# Altium schematic sheet MCU_MISCELLANEOUS.SchDoc
size A3
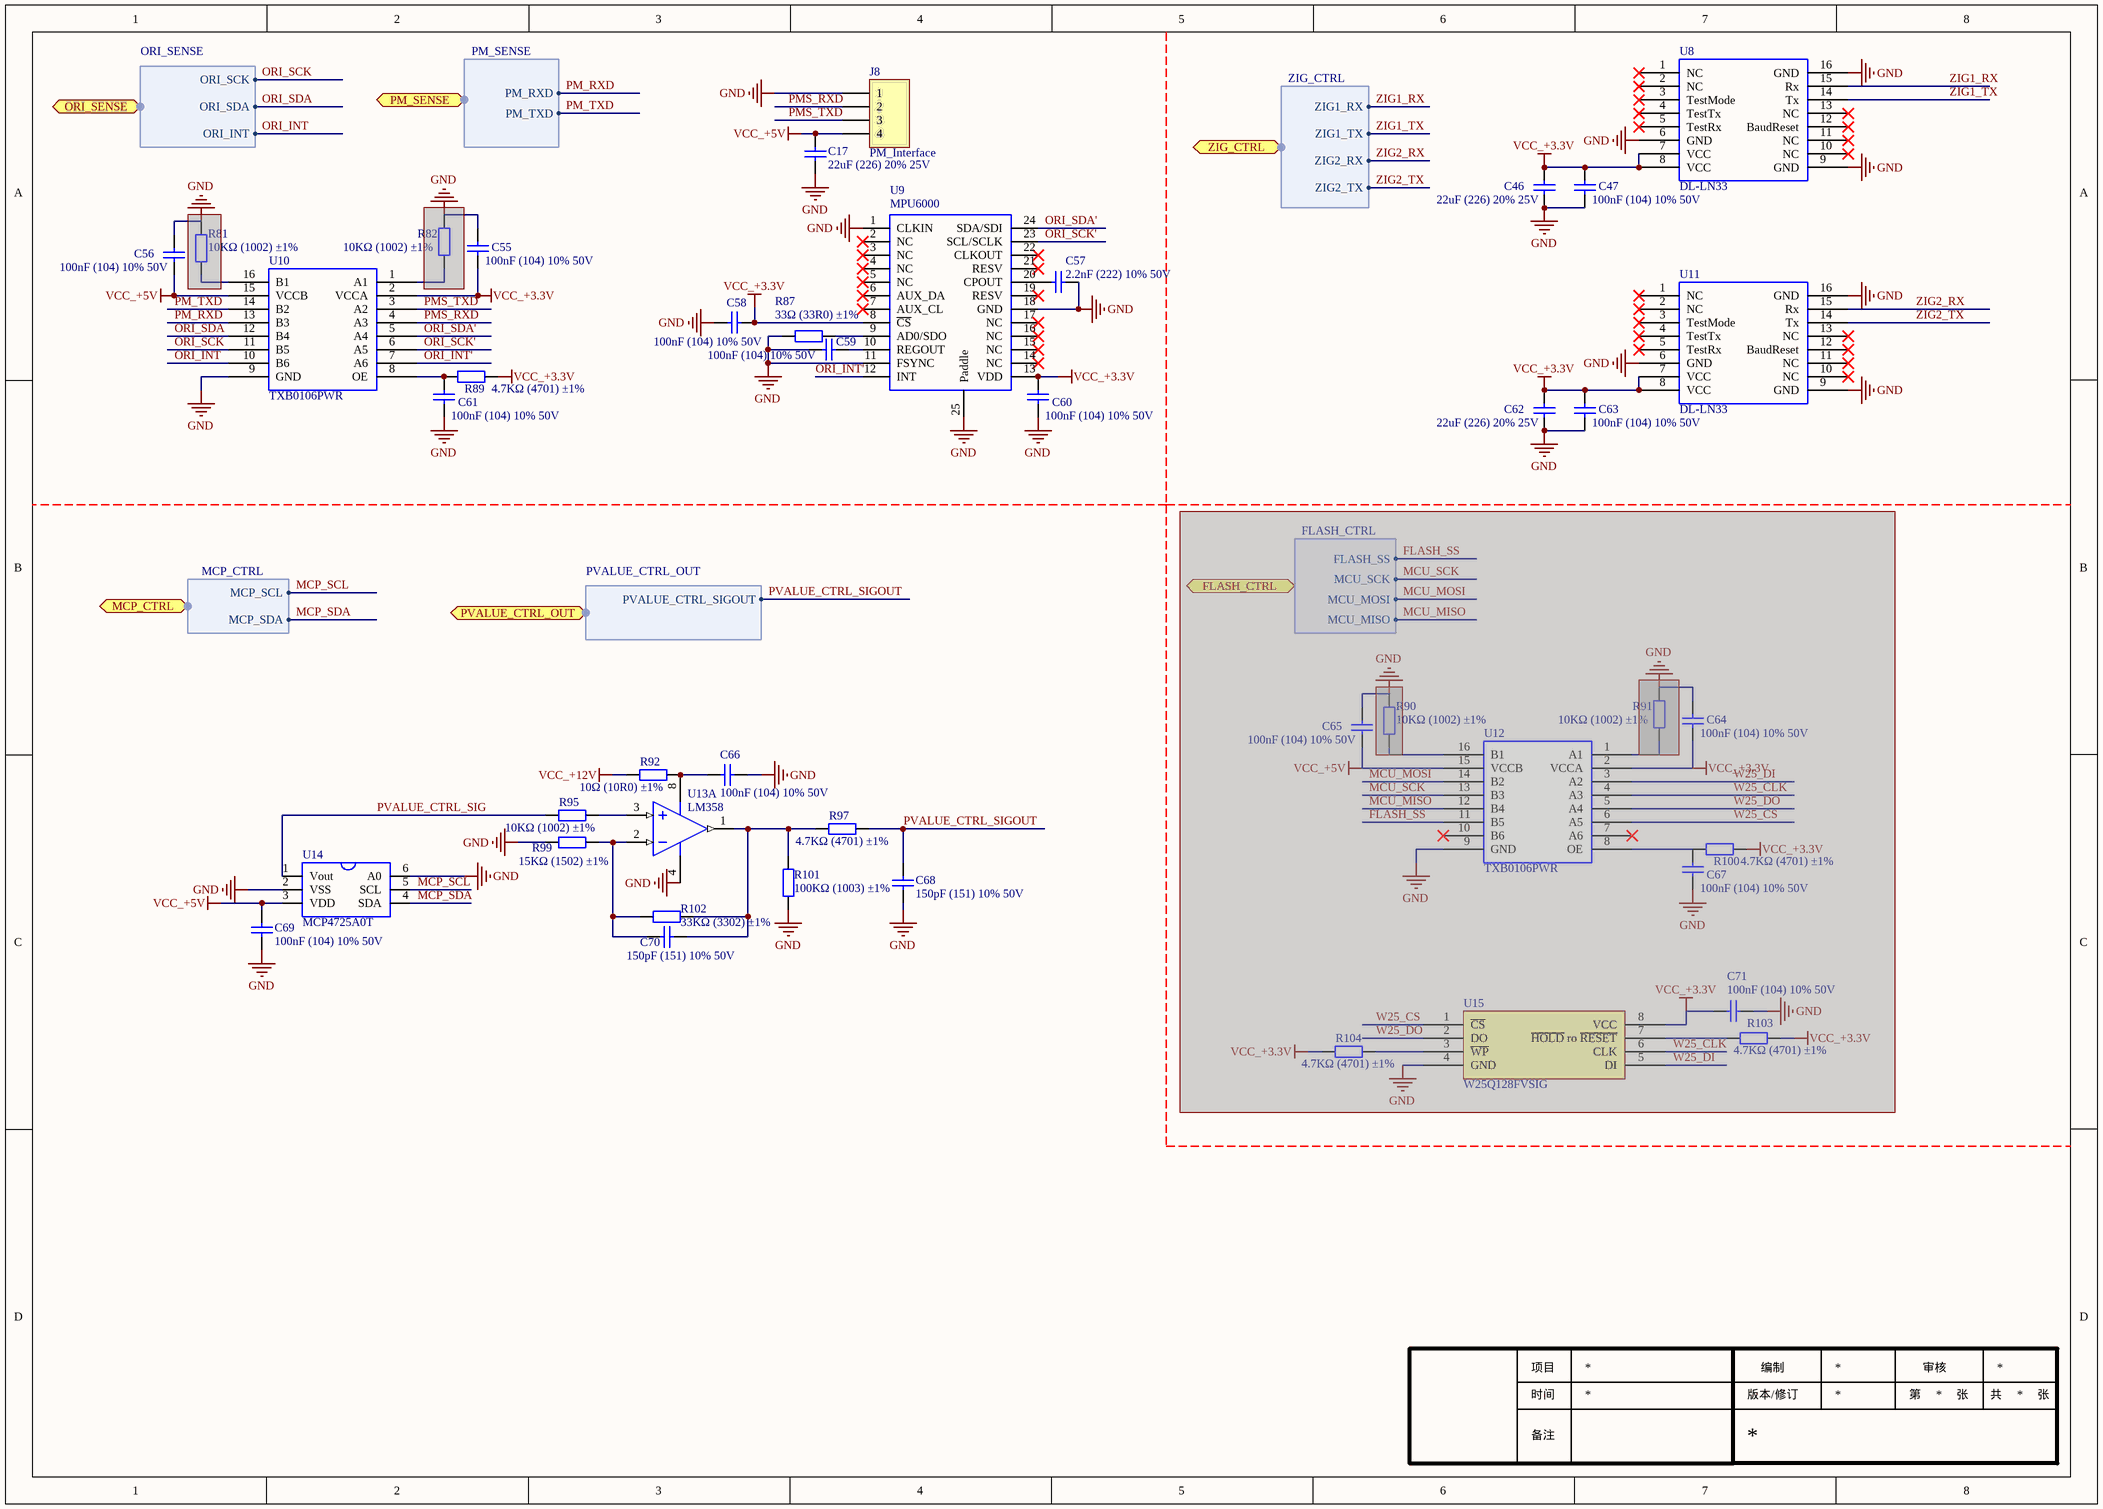
[diagram p0: MCU_MISCELLANEOUS.SchDoc]

## Parts
C17  22uF (226) 20% 25V  [LC-0805_C]
C46  22uF (226) 20% 25V  [LC-0805_C]
C47  100nF (104) 10% 50V  [LC-0603_C]
C55  100nF (104) 10% 50V  [LC-0603_C]
C56  100nF (104) 10% 50V  [LC-0603_C]
C57  2.2nF (222) 10% 50V  [LC-0603_C]
C58  100nF (104) 10% 50V  [LC-0603_C]
C59  100nF (104) 10% 50V  [LC-0603_C]
C60  100nF (104) 10% 50V  [LC-0603_C]
C61  100nF (104) 10% 50V  [LC-0603_C]
C62  22uF (226) 20% 25V  [LC-0805_C]
C63  100nF (104) 10% 50V  [LC-0603_C]
C64  100nF (104) 10% 50V  [LC-0603_C]  (masked out: inside a compile mask, not in the netlist)
C65  100nF (104) 10% 50V  [LC-0603_C]  (masked out: inside a compile mask, not in the netlist)
C66  100nF (104) 10% 50V  [LC-0603_C]
C67  100nF (104) 10% 50V  [LC-0603_C]  (masked out: inside a compile mask, not in the netlist)
C68  150pF (151) 10% 50V  [LC-0603_C]
C69  100nF (104) 10% 50V  [LC-0603_C]
C70  150pF (151) 10% 50V  [LC-0603_C]
C71  100nF (104) 10% 50V  [LC-0603_C]  (masked out: inside a compile mask, not in the netlist)
J8  PM_Interface  [RCJ2.5-4CA]
R81  10KΩ (1002) ±1%  [LC-0603_R]  (masked out: inside a compile mask, not in the netlist)
R82  10KΩ (1002) ±1%  [LC-0603_R]  (masked out: inside a compile mask, not in the netlist)
R87  33Ω (33R0) ±1%  [LC-0603_R]
R89  4.7KΩ (4701) ±1%  [LC-0603_R]
R90  10KΩ (1002) ±1%  [LC-0603_R]  (masked out: inside a compile mask, not in the netlist)
R91  10KΩ (1002) ±1%  [LC-0603_R]  (masked out: inside a compile mask, not in the netlist)
R92  10Ω (10R0) ±1%  [LC-0603_R]
R95  10KΩ (1002) ±1%  [LC-0603_R]
R97  4.7KΩ (4701) ±1%  [LC-0603_R]
R99  15KΩ (1502) ±1%  [LC-0603_R]
R100  4.7KΩ (4701) ±1%  [LC-0603_R]  (masked out: inside a compile mask, not in the netlist)
R101  100KΩ (1003) ±1%  [LC-0603_R]
R102  33KΩ (3302) ±1%  [LC-0603_R]
R103  4.7KΩ (4701) ±1%  [LC-0603_R]  (masked out: inside a compile mask, not in the netlist)
R104  4.7KΩ (4701) ±1%  [LC-0603_R]  (masked out: inside a compile mask, not in the netlist)
U8  DL-LN33  [RCM-DL-LN33]
U9  MPU6000  [RCIC-QFN24]
U10  TXB0106PWR  [RCIC-TSSOP16]
U11  DL-LN33  [RCM-DL-LN33]
U12  TXB0106PWR  [RCIC-TSSOP16]  (masked out: inside a compile mask, not in the netlist)
U13  LM358  [LC-SOIC-8_150mil]  (part A of 2)
U14  MCP4725A0T  [RCIC-SOT-23-6]
U15  W25Q128FVSIG  [LC-SOIC-8_208mil]  (masked out: inside a compile mask, not in the netlist)

## Ports
FLASH_CTRL (harness FLASH_CTRL), MCP_CTRL (harness MCP_CTRL), ORI_SENSE (harness ORI_SENSE), PM_SENSE (harness PM_SENSE), PVALUE_CTRL_OUT (harness PVALUE_CTRL_OUT), ZIG_CTRL (harness ZIG_CTRL)

## Harnesses
FLASH_CTRL: FLASH_SS, MCU_SCK, MCU_MOSI, MCU_MISO
ORI_SENSE: ORI_SCK, ORI_SDA, ORI_INT
ZIG_CTRL: ZIG1_RX, ZIG1_TX, ZIG2_RX, ZIG2_TX
PVALUE_CTRL_OUT: PVALUE_CTRL_SIGOUT
MCP_CTRL: MCP_SCL, MCP_SDA
PM_SENSE: PM_RXD, PM_TXD

## Nets
GND: C17.2 C46.1 C47.1 C57.1 C58.1 C59.2 C60.1 C61.1 C62.1 C63.1 C66.1 C68.2 C69.1 J8.1 R87.1 R99.1 R101.1 U8.6(GND) U8.9(GND) U8.16(GND) U9.1(CLKIN) U9.11(FSYNC) U9.18(GND) U9.25(Paddle) U10.9(GND) U11.6(GND) U11.9(GND) U11.16(GND) U13.4(-Vs) U14.2(VSS) U14.6(A0)
VCC_+3.3V: C46.2 C47.2 C55.1 C58.2 C60.2 C62.2 C63.2 R89.2 U8.7(VCC) U8.8(VCC) U9.8(~{CS}) U9.13(VDD) U10.2(VCCA) U11.7(VCC) U11.8(VCC)
VCC_+5V: C17.1 C56.1 C69.2 J8.4 U10.15(VCCB) U14.3(VDD)
VCC_+12V: R92.1
MCP_SCL: U14.5(SCL) ; port MCP_CTRL.MCP_SCL
MCP_SDA: U14.4(SDA) ; port MCP_CTRL.MCP_SDA
ORI_INT: U10.10(B6) ; port ORI_SENSE.ORI_INT
ORI_INT': U9.12(INT) U10.7(A6)
ORI_SCK: U10.11(B5) ; port ORI_SENSE.ORI_SCK
ORI_SCK': U9.23(SCL/SCLK) U10.6(A5)
ORI_SDA: U10.12(B4) ; port ORI_SENSE.ORI_SDA
ORI_SDA': U9.24(SDA/SDI) U10.5(A4)
PM_RXD: U10.13(B3) ; port PM_SENSE.PM_RXD
PM_TXD: U10.14(B2) ; port PM_SENSE.PM_TXD
PMS_RXD: J8.2 U10.4(A3)
PMS_TXD: J8.3 U10.3(A2)
PVALUE_CTRL_SIG: R95.2 U14.1(Vout)
PVALUE_CTRL_SIGOUT: C68.1 R97.2 ; port PVALUE_CTRL_OUT.PVALUE_CTRL_SIGOUT
ZIG1_RX: U8.15(Rx) ; port ZIG_CTRL.ZIG1_RX
ZIG1_TX: U8.14(Tx) ; port ZIG_CTRL.ZIG1_TX
ZIG2_RX: U11.15(Rx) ; port ZIG_CTRL.ZIG2_RX
ZIG2_TX: U11.14(Tx) ; port ZIG_CTRL.ZIG2_TX
NetC57_2: C57.2 U9.20(CPOUT)
NetC59_1: C59.1 U9.10(REGOUT)
NetC61_2: C61.2 R89.1 U10.8(OE)
NetC66_2: C66.2 R92.2 U13.8(+Vs)
NetC70_1: C70.1 R97.1 R101.2 R102.2 U13.1(OUT)
NetC70_2: C70.2 R99.2 R102.1 U13.2(IN-)
NetR87_2: R87.2 U9.9(AD0/SDO)
NetR95_1: R95.1 U13.3(IN+)

Not connected (* = marked no-connect by the designer): C55 2; C56 2; U8 1(NC)* 2(NC)* 3(TestMode)* 4(TestTx)* 5(TestRx)* 10(NC)* 11(NC)* 12(BaudReset)* 13(NC)*; U9 2(NC)* 3(NC)* 4(NC)* 5(NC)* 6(AUX_DA)* 7(AUX_CL)* 14(NC)* 15(NC)* 16(NC)* 17(NC)* 19(RESV)* 21(RESV)* 22(CLKOUT)*; U10 1(A1) 16(B1); U11 1(NC)* 2(NC)* 3(TestMode)* 4(TestTx)* 5(TestRx)* 10(NC)* 11(NC)* 12(BaudReset)* 13(NC)*

## Notes on the sheet
- 项目
- 时间
- 版本/修订
- 编制
- 第
- 审核
- 张
- 共
- 备注

## Library data of the parts
C17 C46 C62 = 0805 22uF (226) 20% 25V: 贴片电容; ComponentLink1Description: 供应商链接; ComponentLink1URL: http://www.szlcsc.com/product/details_46786.html; Package: 0805; Supplier: LC; SuppliersPartNumber: C45783
C47 C55 C56 C58-C61 C63-C67 C69 C71 = 0603 100nF (104) 10% 50V: 贴片电容; ComponentLink1Description: 供应商链接; ComponentLink1URL: http://www.szlcsc.com/product/details_15331.html; Package: 0603; Supplier: LC; SuppliersPartNumber: C14663
C57 = 0603 2.2nF (222) 10% 50V: 贴片电容; ComponentLink1Description: 供应商链接; ComponentLink1URL: http://www.szlcsc.com/product/details_1956.html; Package: 0603; Supplier: LC; SuppliersPartNumber: C1604
C68 C70 = 0603 150pF (151) 10% 50V: 贴片电容; ComponentLink1Description: 供应商链接; ComponentLink1URL: http://www.szlcsc.com/product/details_1946.html; Package: 0603; Supplier: LC; SuppliersPartNumber: C1594
J8 = SWD_PORT: Comments: PM_Interface; Libnum: *; Manufacture: *; Odering: *
R81 R82 R90 R91 R95 = 0603 10KΩ (1002) 1%: 贴片电阻; ComponentLink1Description: 供应商链接; ComponentLink1URL: http://www.szlcsc.com/product/details_26547.html; Package: 0603; Supplier: LC; SuppliersPartNumber: C25804
R87 = 0603 33Ω (33R0) 1%: 贴片电阻; ComponentLink1Description: 供应商链接; ComponentLink1URL: http://www.szlcsc.com/product/details_23867.html; Package: 0603; Supplier: LC; SuppliersPartNumber: C23140
R89 R97 R100 R103 R104 = 0603 4.7KΩ (4701) 1%: 贴片电阻; ComponentLink1Description: 供应商链接; ComponentLink1URL: http://www.szlcsc.com/product/details_23889.html; Package: 0603; Supplier: LC; SuppliersPartNumber: C23162
R92 = 0603 10Ω (10R0) 1%: 贴片电阻; ComponentLink1Description: 供应商链接; ComponentLink1URL: http://www.szlcsc.com/product/details_23586.html; Package: 0603; Supplier: LC; SuppliersPartNumber: C22859
R99 = 0603 15KΩ (1502) 1%: 贴片电阻; ComponentLink1Description: 供应商链接; ComponentLink1URL: http://www.szlcsc.com/product/details_23536.html; Package: 0603; Supplier: LC; SuppliersPartNumber: C22809
R101 = 0603 100KΩ (1003) 1%: 贴片电阻; ComponentLink1Description: 供应商链接; ComponentLink1URL: http://www.szlcsc.com/product/details_26546.html; Package: 0603; Supplier: LC; SuppliersPartNumber: C25803
R102 = 0603 33KΩ (3302) 1%: 贴片电阻; ComponentLink1Description: 供应商链接; ComponentLink1URL: http://www.szlcsc.com/product/details_4623.html; Package: 0603; Supplier: LC; SuppliersPartNumber: C4216
U8 U11 = DL-LN3X: Zigbee 2.4G Multi-hop AdHos WSN Modules; Manufacture: 深联创新; Comments: DL-LN33; Libnum: *; Ordering: DL-LN33
U9 = MPU60X0
U10 U12 = TXB0106: Octal D type transparent latch; Manufacture: TI; Comments: TXB0106PWR; Libnum: *; Ordering: TXB0106PWR
U13 = LM358: Common AMPLIFIER; Comments: LM358; Libnum: *; Manufacture: *; Ordering: *
U14 = MCP4725: DC-DC电源模块; Manufacture: MicroChip; Ordering: MCP4725A0T-E/CH; Comments: MCP4725A0T
U15 = W25Q128FVSIG: Flash ROM; ComponentLink1Description: 供应商链接; ComponentLink1URL: http://www.szlcsc.com/product/details_36072.html; Package: SOIC-8; Supplier: LC; SuppliersPartNumber: C35101